# EAGLE design Frisbie_Board (EAGLE 9.0.1)
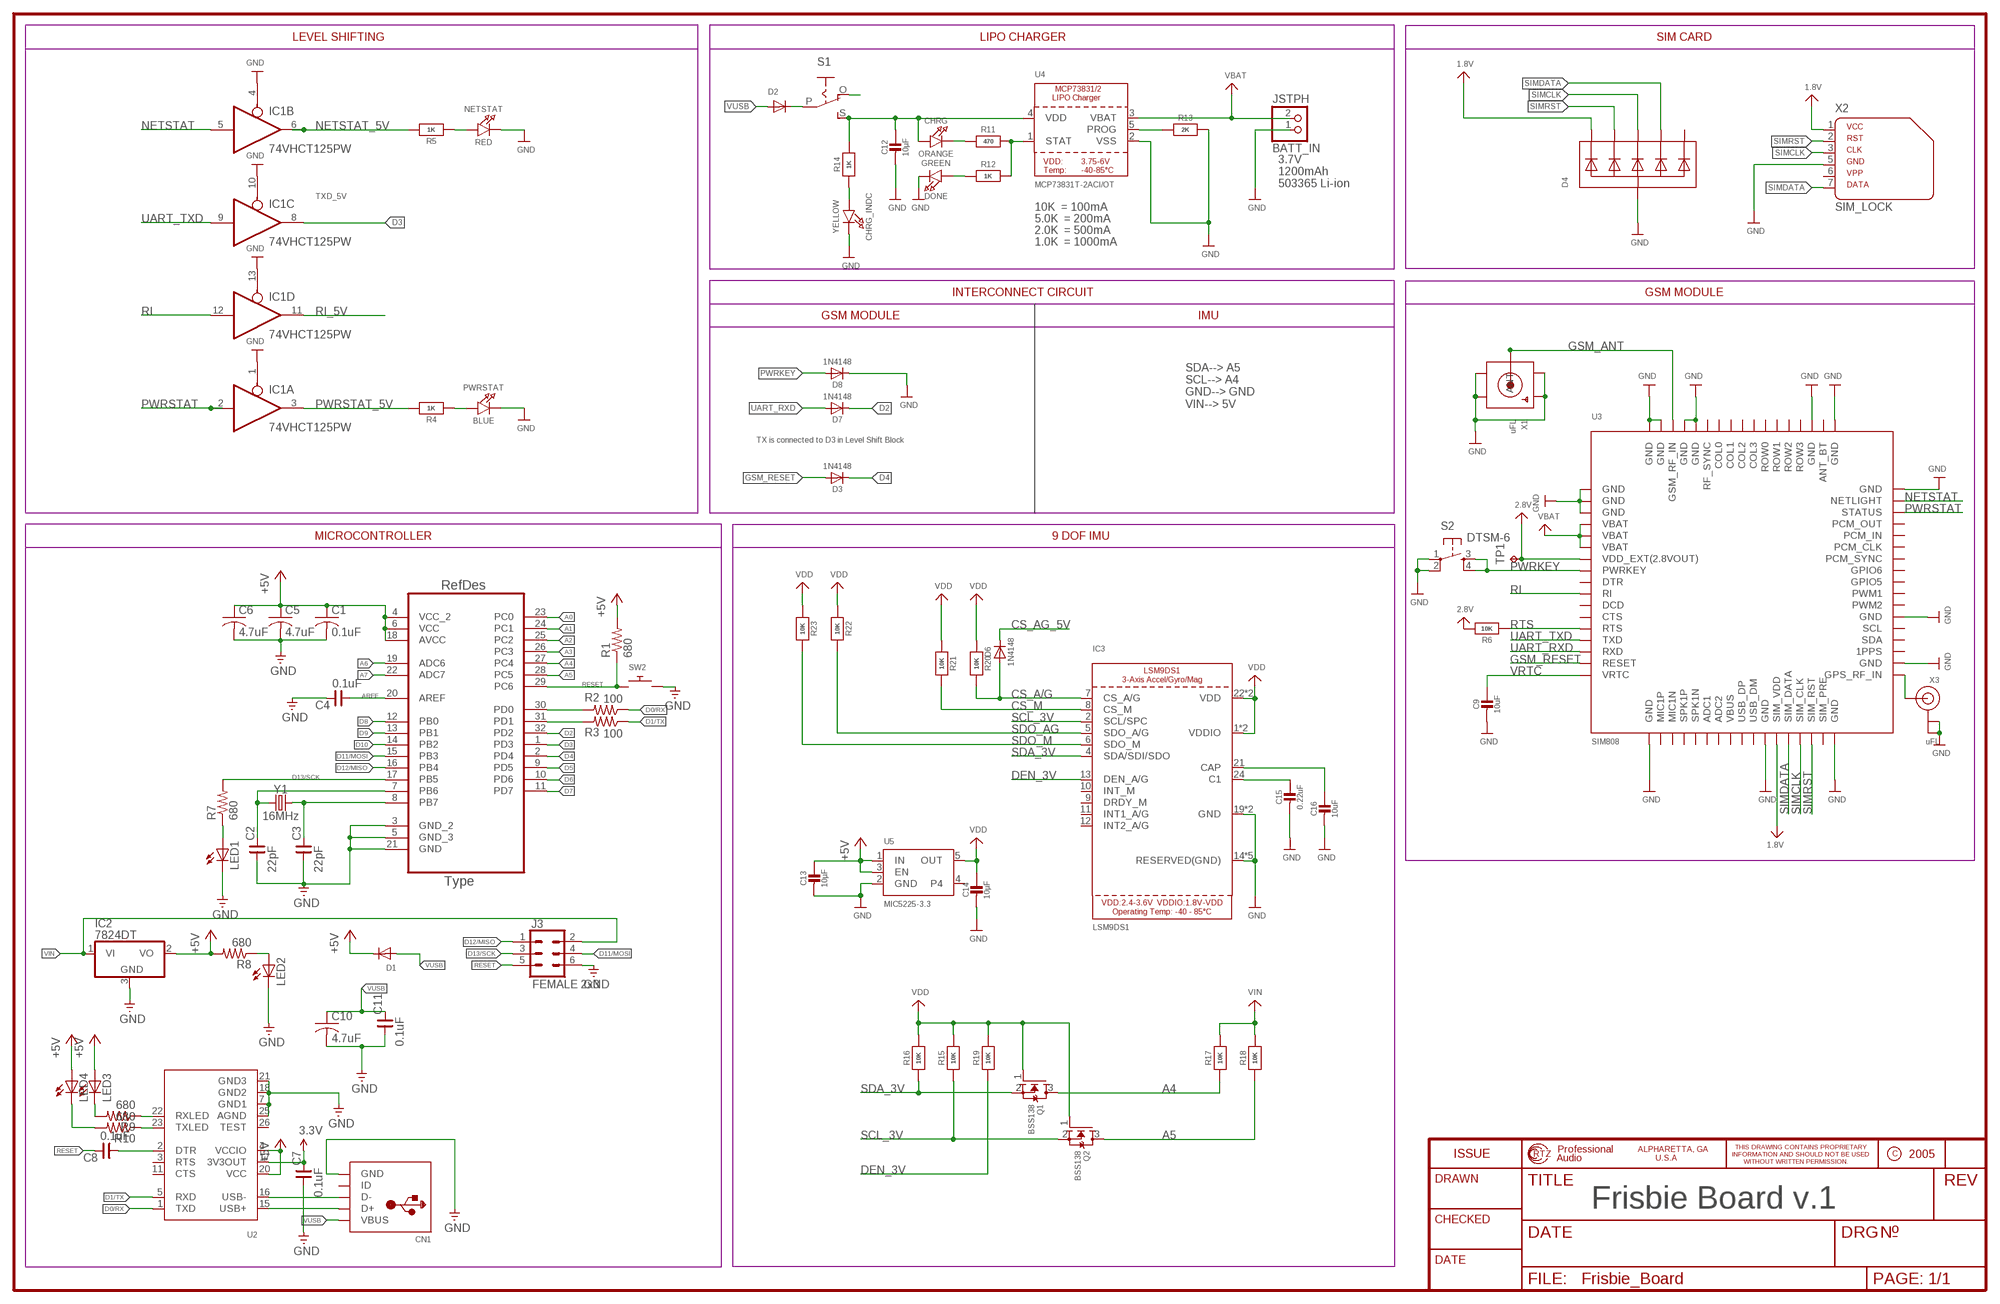
[diagram p0: schematic, sheet 1]

## Parts
BATT_IN  JSTPH  JST_2PIN  [JSTPH2]
C1  0.1uF  C-USC0805  [C0805]
C2  22pF  CNP-0805  [0805]
C3  22pF  CNP-0805  [0805]
C4  0.1uF  CNP-0805  [0805]
C5  4.7uF  C-USC0805  [C0805]
C6  4.7uF  C-USC0805  [C0805]
C7  0.1uF  CNP-0805  [0805]
C8  0.1uF  CNP-0805  [0805]
C9  10uF  CAP_CERAMIC0805-NOOUTLINE  [0805-NO]
C10  4.7uF  C-USC0805  [C0805]
C11  0.1uF  CNP-0805  [0805]
C12  10µF  CAP_CERAMIC0805-NOOUTLINE  [0805-NO]
C13  10µF  CAP_CERAMIC0805-NOOUTLINE  [0805-NO]
C14  10µF  CAP_CERAMIC0805-NOOUTLINE  [0805-NO]
C15  0.22uF  CAP_CERAMIC0805_10MGAP  [0805_10MGAP]
C16  10uF  CAP_CERAMIC0805-NOOUTLINE  [0805-NO]
CHRG  ORANGE  LED0805_NOOUTLINE  [CHIPLED_0805_NOOUTLINE]
CHRG_INDC  YELLOW  LED0805_NOOUTLINE  [CHIPLED_0805_NOOUTLINE]
CN1  USBMINIB  [USB-MINIB]
D1  DIODESOD-123  [SOD-123]
D2  DIODESOD-123  [SOD-123]
D3  1N4148  DIODESOD-323  [SOD-323]
D4  TVSARRAY_5LANE  [SOT363]
D6  1N4148  DIODESOD-323  [SOD-323]
D7  1N4148  DIODESOD-323  [SOD-323]
D8  1N4148  DIODESOD-323  [SOD-323]
DONE  GREEN  LED0805_NOOUTLINE  [CHIPLED_0805_NOOUTLINE]
IC1  74VHCT125PW  74ABT125PW  [TSSOP14]
IC2  7824DT  [TO252]
IC3  LSM9DS1  [LGA24_3.5X3.1MM]
J3  FEMALE 2x3  CONN_03X2FEMALE  [2X3]
LED1  LEDCHIPLED_0805  [CHIPLED_0805]
LED2  LEDCHIPLED_0805  [CHIPLED_0805]
LED3  LEDCHIPLED_0805  [CHIPLED_0805]
LED4  LEDCHIPLED_0805  [CHIPLED_0805]
NETSTAT  RED  LED0805_NOOUTLINE  [CHIPLED_0805_NOOUTLINE]
PWRSTAT  BLUE  LED0805_NOOUTLINE  [CHIPLED_0805_NOOUTLINE]
Q1  BSS138  MOSFET-NWIDE  [SOT23-WIDE]
Q2  BSS138  MOSFET-NWIDE  [SOT23-WIDE]
R1  680  R-US_R0805  [R0805]
R2  100  R-US_R0805  [R0805]
R3  100  R-US_R0805  [R0805]
R4  1K  RESISTOR0805_NOOUTLINE  [0805-NO]
R5  1K  RESISTOR0805_NOOUTLINE  [0805-NO]
R6  10K  RESISTOR0805_NOOUTLINE  [0805-NO]
R7  680  R-US_R0805  [R0805]
R8  680  R-US_R0805  [R0805]
R9  680  R-US_R0805  [R0805]
R10  680  R-US_R0805  [R0805]
R11  470  RESISTOR0805_NOOUTLINE  [0805-NO]
R12  1K  RESISTOR0805_NOOUTLINE  [0805-NO]
R13  2K  RESISTOR0805_NOOUTLINE  [0805-NO]
R14  1K  RESISTOR0805_NOOUTLINE  [0805-NO]
R15  10K  RESISTOR0805_NOOUTLINE  [0805-NO]
R16  10K  RESISTOR0805_10MGAP  [0805_10MGAP]
R17  10K  RESISTOR0805_NOOUTLINE  [0805-NO]
R18  10K  RESISTOR0805_NOOUTLINE  [0805-NO]
R19  10K  RESISTOR0805_NOOUTLINE  [0805-NO]
R20  10K  RESISTOR0805_NOOUTLINE  [0805-NO]
R21  10K  RESISTOR0805_NOOUTLINE  [0805-NO]
R22  10K  RESISTOR0805_10MGAP  [0805_10MGAP]
R23  10K  RESISTOR0805_NOOUTLINE  [0805-NO]
S1  EG1218S  [EG1218]
S2  DTSM-6  [DTSM-6]
SW2  SWITCH_PUSHBUTTONEVQ-PE  [TACT_PANA-EVQ]
TP1  TPTP11R  [TP11R]
U1  ATMEGA328P-AU  [QFP80P900X900X120-32N]
U2  FT232RLSSOP28  [SSOP28DB]
U3  SIM808  GSM_SIM808_LITERAL  [SIM900_SMT]
U4  MCP73831T-2ACI/OT  MCP73831/2  [SOT23-5]
U5  MIC5225-3.3  VREG_SOT23-5  [SOT23-5]
X1  uFL  SMACONNECTOR_EDGE_UFL  [SMA_EDGELAUNCH_UFL]
X2  SIM_LOCK  [SIM_5002]
X3  uFL  ANTENNA_U.FL  [U.FL]
Y1  16MHz  CRYSTAL-16MHZPTH-HC49US  [HC49US]

## Nets
1.8V: D4.1(C1) U3.P$29(SIM_VDD) X2.1
2.8V: R6.2 TP1.TP U3.P$7(VDD_EXT(2.8VOUT))
3.3V: C7.2 U2.17(3V3OUT)
+5V: C1.1 C5.1 C6.1 C13.1 D1.C IC2.2(VO) LED3.A LED4.A R1.2 R8.2 U1.4(VCC_2) U1.6(VCC) U1.18(AVCC) U2.4(VCCIO) U2.20(VCC) U5.1(IN) U5.3(EN)
A0: U1.23(PC0)
A1: U1.24(PC1)
A2: U1.25(PC2)
A3: U1.26(PC3)
A4: Q1.3(D) R17.1 U1.27(PC4)
A5: Q2.3(D) R18.1 U1.28(PC5)
A6: U1.19(ADC6)
A7: U1.22(ADC7)
AREF: C4.1 U1.20(AREF)
C1: C15.1 IC3.24(C1)
CAP: C16.1 IC3.21(CAP)
CS_A/G: D6.A IC3.7(CS_A/G) R20.2
CS_AG_5V: D6.C
CS_M: IC3.8(CS_M) R21.2
D0/RX: R2.1 U2.1(TXD)
D1/TX: R3.1 U2.5(RXD)
D2: D7.C U1.32(PD2)
D3: IC1.8(C:O) U1.1(PD3)
D4: D3.C U1.2(PD4)
D5: U1.9(PD5)
D6: U1.10(PD6)
D7: U1.11(PD7)
D8: U1.12(PB0)
D9: U1.13(PB1)
D10: U1.14(PB2)
D11/MOSI: J3.4 U1.15(PB3)
D12/MISO: J3.1 U1.16(PB4)
D13/SCK: J3.3 R7.2 U1.17(PB5)
DEN_3V: IC3.13(DEN_A/G) R19.1
GND: BATT_IN.1 C1.2 C2.1 C3.1 C4.2 C5.2 C6.2 C7.1 C9.2 C10.2 C11.1 C12.2 C13.2 C14.2 C15.2 C16.2 CHRG_INDC.C CN1.GND D4.2(A) D8.C DONE.C IC1.1(A:OE) IC1.4(B:OE) IC1.10(C:OE) IC1.13(D:OE) IC2.3(GND) IC3.14(RESERVED(GND)) IC3.15(RESERVED(GND)) IC3.16(RESERVED(GND)) IC3.17(RESERVED(GND)) IC3.18(RESERVED(GND)) IC3.19(GND) IC3.20(GND) J3.6 LED1.C LED2.C NETSTAT.C PWRSTAT.C R13.2 S2.1 S2.2 SW2.P$2 U1.3(GND_2) U1.5(GND_3) U1.21(GND) U2.7(GND1) U2.18(GND2) U2.21(GND3) U2.25(AGND) U3.P$1(GND) U3.P$2(GND) U3.P$3(GND) U3.P$18(GND) U3.P$28(GND) U3.P$34(GND) U3.P$36(GND) U3.P$40(GND) U3.P$51(GND) U3.P$52(GND) U3.P$54(GND) U3.P$64(GND) U3.P$65(GND) U3.P$67(GND) U3.P$68(GND) U4.2(VSS) U5.2(GND) X1.GND@1(GND1) X1.GND@2(GND2) X1.GND@3(GND3) X1.GND@4(GND4) X2.5 X3.1(GND) X3.2(GND)
GSM_ANT: U3.P$66(GSM_RF_IN) X1.P(ANT)
GSM_RESET: D3.A U3.P$16(RESET)
N$1: C3.2 U1.8(PB7) Y1.2
N$2: C2.2 U1.7(PB6) Y1.1
N$3: U3.P$35(GPS_RF_IN) X3.3(SIGNAL)
N$4: PWRSTAT.A R4.1
N$6: LED2.A R8.1
N$7: R2.2 U1.30(PD0)
N$8: R3.2 U1.31(PD1)
N$9: NETSTAT.A R5.1
N$10: CN1.D+ U2.15(USB+)
N$11: CN1.D- U2.16(USB-)
N$12: R9.1 U2.22(RXLED)
N$13: R10.1 U2.23(TXLED)
N$14: LED3.C R9.2
N$15: LED4.C R10.2
N$16: C8.1 U2.2(DTR)
N$17: CHRG.C R11.1
N$18: R11.2 R12.2 U4.1(STAT)
N$19: R13.1 U4.5(PROG)
N$20: DONE.A R12.1
N$21: C12.1 CHRG.A R14.2 S1.S U4.4(VDD)
N$22: D2.C S1.P
N$23: S1.O
N$24: CHRG_INDC.A R14.1
N$25: LED1.A R7.1
NETSTAT: IC1.5(B:I) U3.P$50(NETLIGHT)
NETSTAT_5V: IC1.6(B:O) R5.2
PWRKEY: D8.A S2.3 S2.4 U3.P$8(PWRKEY)
PWRSTAT: IC1.2(A:I) U3.P$49(STATUS)
PWRSTAT_5V: IC1.3(A:O) R4.2
RESET: C8.2 J3.5 R1.1 SW2.P$1 U1.29(PC6)
RI: IC1.12(D:I) U3.P$10(RI)
RI_5V: IC1.11(D:O)
RTS: R6.1 U3.P$13(RTS)
SCL_3V: IC3.2(SCL/SPC) Q2.2(S) R15.1
SDA_3V: IC3.4(SDA/SDI/SDO) Q1.2(S) R16.1
SDO_AG: IC3.5(SDO_A/G) R22.2
SDO_M: IC3.6(SDO_M) R23.2
SIMCLK: D4.4(C3) U3.P$31(SIM_CLK) X2.3
SIMDATA: D4.5(C4) U3.P$30(SIM_DATA) X2.7
SIMRST: D4.3(C2) U3.P$32(SIM_RST) X2.2
UART_RXD: D7.A U3.P$15(RXD)
UART_TXD: IC1.9(C:I) U3.P$14(TXD)
VBAT: BATT_IN.2 U3.P$4(VBAT) U3.P$5(VBAT) U3.P$6(VBAT) U4.3(VBAT)
VDD: C14.1 IC3.1(VDDIO) IC3.3(VDDIO) IC3.22(VDD) IC3.23(VDD) Q1.1(G) Q2.1(G) R15.2 R16.2 R19.2 R20.1 R21.1 R22.1 R23.1 U5.5(OUT)
VIN: IC2.1(VI) J3.2 R17.2 R18.2
VRTC: C9.1 U3.P$17(VRTC)
VUSB: C10.1 C11.2 CN1.VBUS D1.A D2.A
Unconnected: CN1.ID D4.6(C5) IC3.9(DRDY_M) IC3.10(INT_M) IC3.11(INT1_A/G) IC3.12(INT2_A/G) U2.3(RTS) U2.11(CTS) U2.26(TEST) U3.P$9(DTR) U3.P$11(DCD) U3.P$12(CTS) U3.P$19(MIC1P) U3.P$20(MIC1N) U3.P$21(SPK1P) U3.P$22(SPK1N) U3.P$23(ADC1) U3.P$24(ADC2) U3.P$26(USB_DP) U3.P$27(USB_DM) U3.P$33(SIM_PRE) U3.P$37(1PPS) U3.P$38(SDA) U3.P$39(SCL) U3.P$41(PWM2) U3.P$42(PWM1) U3.P$43(GPIO5) U3.P$44(GPIO6) U3.P$45(PCM_SYNC) U3.P$46(PCM_CLK) U3.P$47(PCM_IN) U3.P$48(PCM_OUT) U3.P$53(ANT_BT) U3.P$55(ROW3) U3.P$56(ROW2) U3.P$57(ROW1) U3.P$58(ROW0) U3.P$59(COL3) U3.P$60(COL2) U3.P$61(COL1) U3.P$62(COL0) U3.P$63(RF_SYNC) U5.4 X2.6

## Notes on the sheet
- LEVEL SHIFTING | LIPO CHARGER | SIM CARD
- 3.7V
  1200mAh
  503365 Li-ion
- TXD_5V
- 10K  = 100mA
- 5.0K  = 200mA
- 2.0K  = 500mA
- 1.0K  = 1000mA
- INTERCONNECT CIRCUIT | GSM MODULE
- GSM MODULE | IMU
- SDA--> A5
  SCL--> A4
  GND--> GND
  VIN--> 5V
- TX is connected to D3 in Level Shift Block
- MICROCONTROLLER | 9 DOF IMU
- Frisbie Board v.1

## Power pins joined to a net without a drawn wire
GND: IC1.7(P:GND)
VCC: IC1.14(P:VCC)
VUSB: U3.P$25(VBUS)

## Library data of the parts
BATT_IN = microbuilder:JST_2PIN: JST 2-Pin Right-Angle Connector PH-Series - 4UConnector: 17311 SH-Series - 4UConnector: 07278
C1 C5 C6 C10 = adafruit:C-US: CAPACITOR, American symbol
C2-C4 C7 C8 C11 = cap-master:CNP-: NON-POLARIZED CAP
C9 C12-C16 = microbuilder:CAP_CERAMIC: Ceramic Capacitors For new designs, use the packages preceded by an '_' character since they are more reliable: The following footprints should be used on most boards: _0402 - Standard footprint for regular board layouts _0603 - Standard footprint for regular board layouts _0805 - Standard footprint for regular board layouts _1206 - Standard footprint for regular board layouts For extremely tight-pitch boards where space is at a premium, the following 'micro-pitch' footprints can be used (smaller pads, no silkscreen outline, etc.): _0402MP - Micro-pitch footprint for very dense/compact boards _0603MP - Micro-pitch footprint for very dense/compact boards _0805MP - Micro-pitch footprint for very dense/compact boards _1206MP - Micro-pitch footprint for very dense/compact boards
CHRG CHRG_INDC DONE NETSTAT PWRSTAT = microbuilder:LED: LED
CN1 = adafruit:USB: USB Connectors USBMINIB - Surface Mount Female Mini-B USB Connector 4UConnector: 06564 By microbuilder.eu Thru-hole RA Female Mini-B USB Connector 4UConnector: 18732 By ladyada.net
D1 D2 = adafruit:DIODE: Diode
D3 D6-D8 = microbuilder:DIODE: Diode
D4 = microbuilder:TVSARRAY_5LANE: Voltage Transient Suppressor Array SOT363 SMF05C - 100W 5V: Digikey - SMF05CT1GOSCT-ND
IC1 = 74xx-us:74*125: Quad bus BUFFER, 3-state
IC2 = adafruit:78*: Positive VOLTAGE REGULATOR Added bigger pads to the TO-92 package
IC3 = microbuilder:LSM9DS1
J3 = SparkFun-Connectors:CONN_03X2: Multi connection point. Often used as Generic Header-pin footprint for 0.1 inch spaced/style header connections You can populate with any combo of single row headers, but if you'd like an exact match, check these: Header - 2x3 (Male, 0.1") <https://www.sparkfun.com/products/12807> (PRT-12807) Header - 2x3 (Female, 0.1") <https://www.sparkfun.com/products/13010> (PRT-13010) 2x3 Pin Shrouded Header <https://www.sparkfun.com/products/10877> (PRT-10877) On any of the 0.1 inch spaced packages, you can populate with these: Break Away Headers - Straight <https://www.sparkfun.com/products/116> (PRT-00116) Break Away Male Headers - Right Angle <https://www.sparkfun.com/products/553> (PRT-00553) Female Headers <https://www.sparkfun.com/products/115> (PRT-00115) Break Away Headers - Machine Pin <https://www.sparkfun.com/products/117> (PRT-00117) Break Away Female Headers - Swiss Machine Pin <https://www.sparkfun.com/products/743> (PRT-00743) Special note: the shrouded connector mates well with our 3x2 ribbon cables: Ribbon Crimp Connector - 6-pin (2x3, Female) <https://www.sparkfun.com/products/10651> (PRT-10651) Ribbon Cable - 6 wire (15ft) <https://www.sparkfun.com/products/10646> (PRT-10646); PROD_ID: CONN-11566
LED1-LED4 = adafruit:LED: LED
Q1 Q2 = microbuilder:MOSFET-N: N-Channel Mosfet LEGEND VDS: Voltage Drain-Source ID: Drain Current RDS(ON): Drain-Source On-State Resistance VGS(TH): Gate-Source Threshold Voltage CISS: Drain-Source Input Capacitance SOT-23 Name VDS ID RDS(ON) VGS(TH) CISS Order Number 2N7002E 60V 260mA 2.5 Ohm 2.5V @ 250uA 26.7pF @ 25V 2N7002ET1GOSTR-ND BSH103 30V 850mA 400 mOhm 400mV @ 1mA 83pF @ 24V BSH103,235-ND BSS138 60V 320mA 1.6 Ohm 1.5V @ 250uA 50pF @ 10V Mouser: 771-BSS138PW115 DMN2075U-7 20V 4.2A 38 mOhm 1V @ 250 uA 594.3pF @ 10V DMN2075U-7DICT-ND * BSS138 good choice for I2C level-shifting POWERPAK 1212-8 Name VDS ID RDS(ON) VGS(TH) CISS Order Number Si7308DN 60V 6A 58 mOhm 3V @ 250uA 665pF @ 15V SI7308DN-T1-E3CT-ND
R1-R3 R7-R10 = adafruit:R-US_: RESISTOR, American symbol
R4-R6 R11-R23 = microbuilder:RESISTOR: Resistors For new designs, use the packages preceded by an '_' character since they are more reliable: The following footprints should be used on most boards: _0402 - Standard footprint for regular board layouts _0603 - Standard footprint for regular board layouts _0805 - Standard footprint for regular board layouts _1206 - Standard footprint for regular board layouts For extremely tight-pitch boards where space is at a premium, the following 'micro-pitch' footprints can be used (smaller pads, no silkscreen outline, etc.): _0402MP - Micro-pitch footprint for very dense/compact boards _0603MP - Micro-pitch footprint for very dense/compact boards _0805MP - Micro-pitch footprint for very dense/compact boards _1206MP - Micro-pitch footprint for very dense/compact boards
S1 = adafruit:EG1218: SLIDING SWITCH 0.1" spacing through hole, vertical SPDT slide switch http://www.ladyada.net/library/pcb/eaglelibrary.html
S2 = switch-tact:DTSM-6
SW2 = adafruit:SWITCH_PUSHBUTTON: Buttons SOFTTOUCHSMD_SJ - Soft touch temporary push button (Super Junk Akihabara) Compatible with SKPMANE010 [Mouser: 688-SKPMAN] C&K_KSS = Digikey: KSS221GLFS
TP1 = testpad:TP: Test pad
U1 = Atmel-ATMEGA328P-AU:ATMEGA328P-AU; DESCRIPTION: 8-bit Microcontroller with In-System Programmable Flash; MPN: ATMEGA328P-AU; OC_FARNELL: 1715486; OC_NEWARK: 14R4631; PACKAGE: TQFP-32; SUPPLIER: Atmel
U2 = microbuilder:FT232RL: FTDI FT232RL USB TO RS232 Converter Digikey: 768-1007-1-ND
U3 = microbuilder:GSM_SIM808_LITERAL: SIM808 GSM Module
U4 = microbuilder:MCP73831/2: MCP73831/2 LIPO Charger VDD: 3.75 - 6V Temp -40 - 85°C Programmable Charge Rate: 15-500mA NOTE: STAT is a tri-state logic output on the MCP73831 and an open-drain output on the MCP73832. SOT23-5 with 4.2V output and tri-state logic on STAT = MCP73831T-2ACI/OT
U5 = microbuilder:VREG_SOT23-5: SOT23-5 Fixed Voltage Regulators Part Current Out V Out V In V Dropout θJA (°C/W) TJ (°C) Digikey Part No. ADP121 150mA 3.3V 3.4-5.5V 0.09V @ 150mA -- -- ADP121-AUJZ33R7CT-ND ADP121 150mA 3.0V 3.1-5.5V 0.09V @ 150mA -- -- ADP121-AUJZ30R7CT-ND ADP122 300mA 3.3V 3.4-5.5V 0.085V @ 300mA -- -- ADP122AUJZ-3.3-R7CT-ND ADP1712 300mA 3.3V 3.5-5.5V 0.17V @ 300mA -- -- ADP1712AUJZ-3.3-R7TR-ND AP7311 (Low Cost) 150mA 3.3V 3.5-6V 0.15V @ 150mA -- -- AP7311-33WG-7DICT-ND LD39015M18R 150mA 1.8V 1.9V-5.5V 0.08V @ 100mA -- -- 497-6977-1-ND LP2985A-33DBVR 150mA 3.3V 3.3-16V 0.28V @ 150mA 206 150 296-18479-1-ND MCP1824T-3302E/OT 300mA 3.3V 3.5V-6V 0.2V @ 300mA -- -- MCP1824T-3302E/OTCT-ND MIC5205-2.5YM5 TR 150mA 2.5V 2.7-16V 0.165V @ 150mA -- -- 576-1257-2-ND MIC5205-3.0YM5 TR 150mA 3.0V 3.2V-16V 0.165V @ 150mA -- -- 576-1258-2-ND MIC5205-3.3YM5 TR 150mA 3.3V 3.5V-16V 0.165V @ 150mA -- -- 576-1259-2-ND TPS780330220 150mA 3.3V+2.2V 3.6-5.5V 250mV Max -- -- 296-23332-1-ND TDA3663/N1,135 100mA 3.3V 3.5-45V 0.18V @ 50mA -- -- 568-5343-1-ND Max operating temp can be calculated using θJA, TJ (max junction temperature), and power in watts. Set the "Maximum Ambient Temperature" until it reaches TJ ("Max Junction Temperature"), which is the absolute limit for safe use of the regulator: Heat Sink Temperature Calculator <http://www.daycounter.com/Calculators/Heat-Sink-Temperature-Calculator.phtml> For example, With 12V source into a 3.3V LP2985 and a 30mA load, we are dissipating (12V-3.3V) * 0.03A = 0.261W. With a θJA of 206 °C/W, a TJ of 150°C, and 261mW we can safely use the chip without a heat sink up to 75°C (=147.1°C Junction Temperature).
X1 = microbuilder:SMACONNECTOR: SMA Connector 90° DIP SMA Connector, 50 Ohm (4UConnector: 07259)
X2 = microbuilder:SIM_LOCK: C707A SIMLOCK® 2.5 mm with wide solder tails Source: Data sheet <http://www.amphenol.info/downloads/C707_10M006_512_2.pdf>
X3 = microbuilder:ANTENNA_U.FL: U.FL Antenna Connector
Y1 = SparkFun-Clocks:CRYSTAL-16MHZ: 16MHz Crystal Digikey Example <http://www.digikey.com/product-search/en?keywords=535-9122-1-ND> Frequency: 16MHz Frequency Stability: ±50ppm Frequency Tolerance: ±20ppm Load Capacitance: 18pF SparkFun Products: Pro Micro -5V/16MHz <https://www.sparkfun.com/products/12640> SparkFun Serial Enabled LCD Kit <https://www.sparkfun.com/products/10097>; PROD_ID: XTAL-08181; SF_ID: COM-00536

## Board
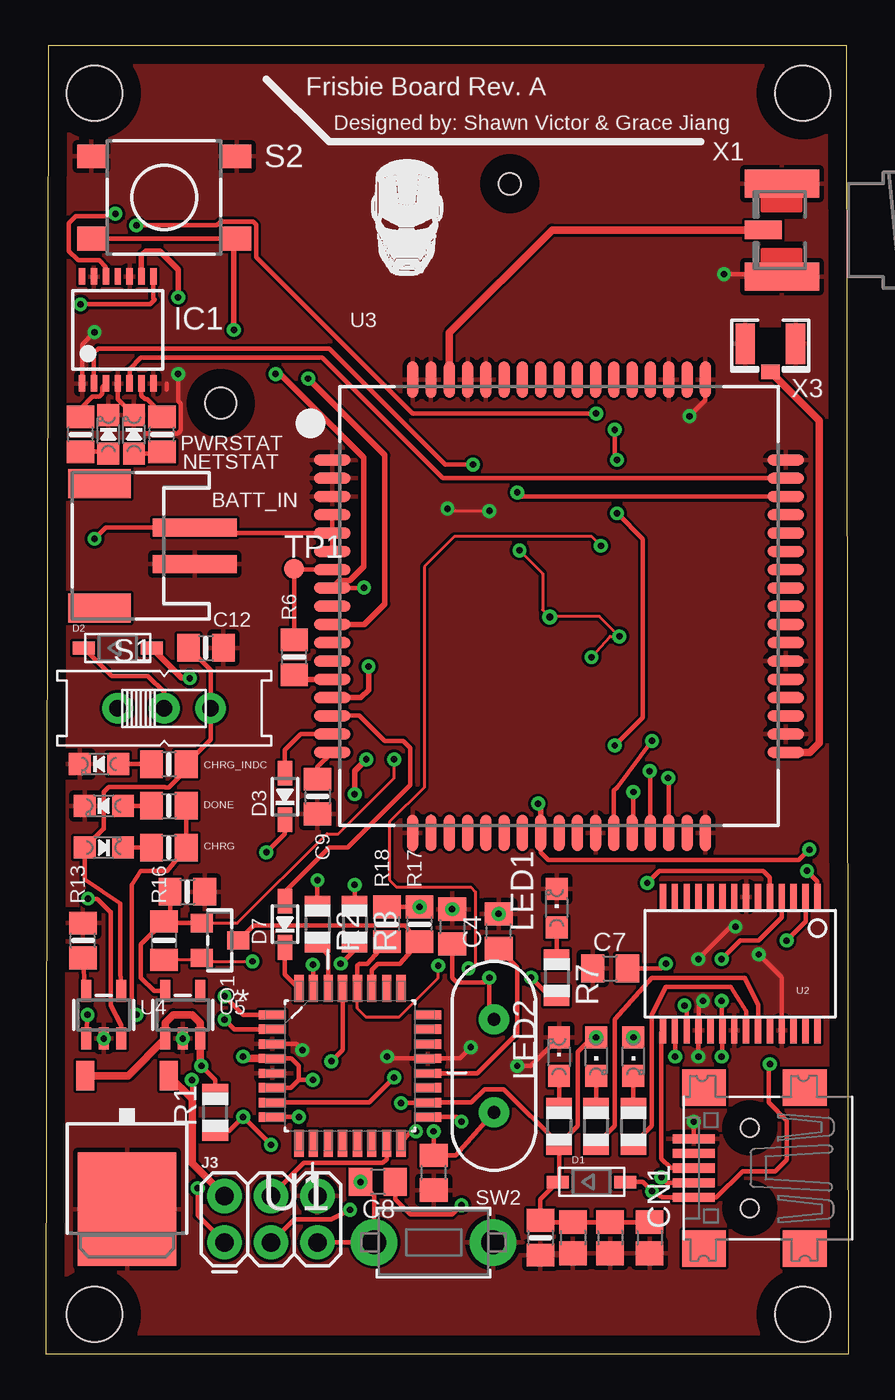
[diagram p1: board, top side]
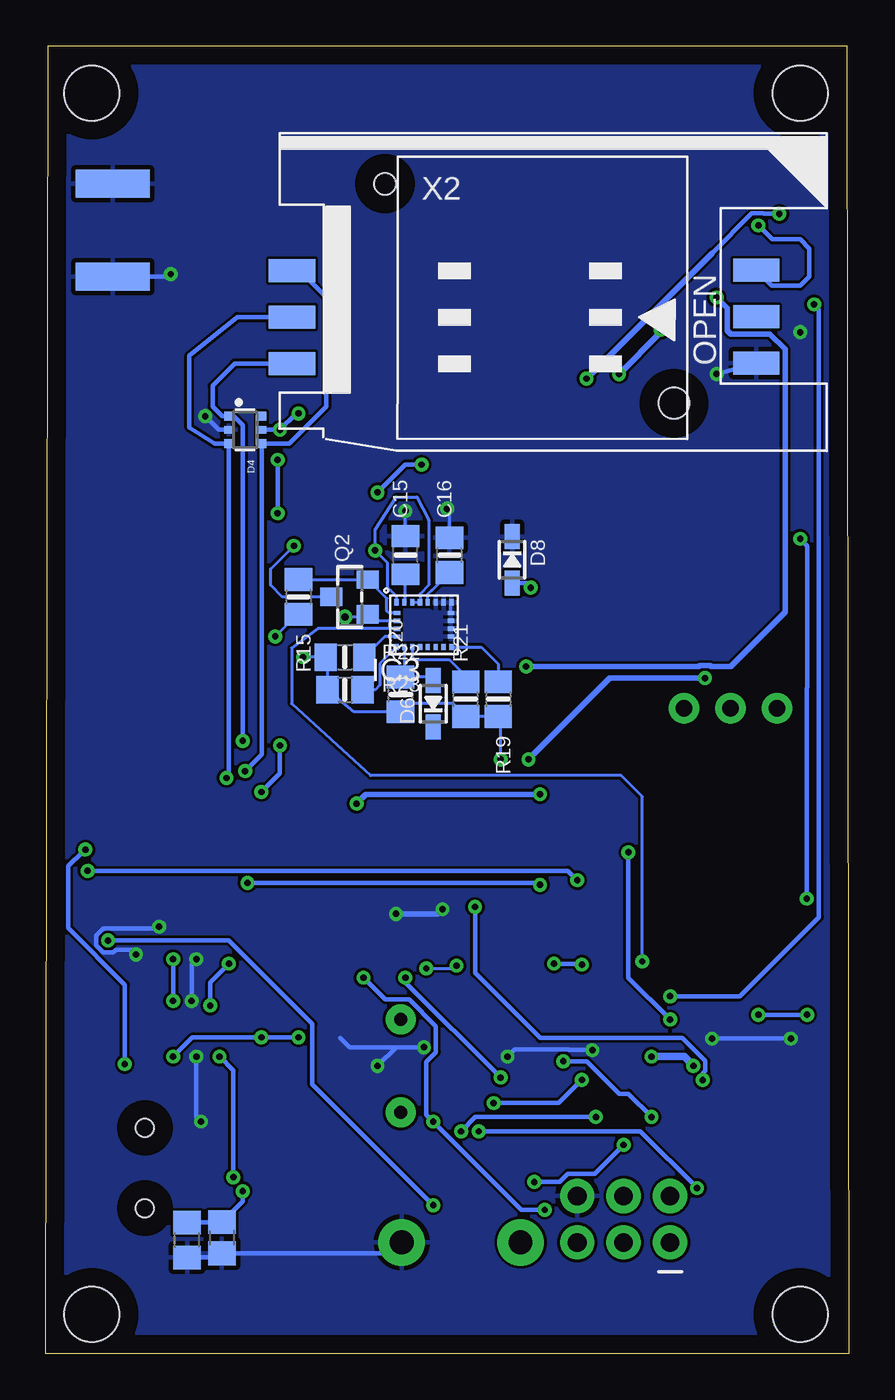
[diagram p2: board, bottom side, seen from below]

Size 43.92 x 71.55 mm. Coordinates in mm from the lower left corner, seen from the top.
Outline: 0,0 43.92,0 43.8,71.55 0.13,71.55 0,0
Copper layers (1*16): Top 0.035mm / dielectric 1.5mm / Bottom 0.035mm
Design rules "default": minimum track width 6mil, minimum drill 0.35mm, track to track 6mil, track to pad 6mil, pad to pad 6mil, via to via 6mil, smd to smd 6mil, copper to edge 40mil, drill to drill 6mil, minimum pad ring 10mil, minimum via ring 8mil, stop-mask expansion 4mil, vias tented up to drill 0mil, thermal gap 10mil
Holes 3.02 mm at 2.67,2.16 41.4,2.16 2.67,68.96 41.4,68.96

### Footprints (pad centres in the part's own frame; a part is rotated, then mirrored left to right if it is on the bottom)
JSTPH2 = smd 1 x 4.6: 1 -1,-3.7; 2 1,-3.7 | smd 1.6 x 3.4: NC1 -3.4,1.5; NC2 3.4,1.5
C0805 = smd 1.3 x 1.5: 1 -0.85,0; 2 0.85,0
0805 = smd 1.27 x 1.524: 1 -0.953,0; 2 0.953,0
0805-NO = smd 1.24 x 1.5: 1 -0.95,0; 2 0.95,0
0805_10MGAP = smd 1.2 x 1.5: 1 -1.05,0; 2 1.05,0
CHIPLED_0805_NOOUTLINE = smd 1.2 x 1.2: A 0,-1.05; C 0,1.05
USB-MINIB = smd 0.5 x 2.308: D+ 0,4.064; D- -0.8,4.064; GND 1.6,4.064; ID 0.8,4.064; VBUS -1.6,4.064 | smd 2 x 2.4: GND1 -4.4,-2; GND2 -4.4,3.5; GND3 4.4,3.5; GND4 4.4,-2 | hole 1: -2.2,1; 2.2,1
SOD-123 = smd 1.2 x 0.7: A 1.85,0; C -1.85,0
SOD-323 = smd 1.35 x 0.8: A 1.27,0; C -1.27,0
SOT363 = smd 0.5 x 0.5: 1 -0.75,-0.9; 3 0.75,-0.9; 4 0.75,0.9; 6 -0.75,0.9 | smd 0.4 x 0.5: 2 0,-0.9; 5 0,0.9
TSSOP14 = smd 0.35 x 0.9: 1 -1.95,-2.925; 2 -1.3,-2.925; 3 -0.65,-2.925; 4 0,-2.925; 5 0.65,-2.925; 6 1.3,-2.925; 7 1.95,-2.925; 8 1.95,2.925; 9 1.3,2.925; 10 0.65,2.925; 11 0,2.925; 12 -0.65,2.925; 13 -1.3,2.925; 14 -1.95,2.925
TO252 = smd 1 x 1.6: 1 -2.28,-4.8; 2 2.28,-4.8 | smd 5.4 x 6.2: 3 0,2.5
LGA24_3.5X3.1MM = smd 0.23 x 0.35: 1 -1.505,1.22; 6 -1.505,-1.22; 7 -1.075,-1.22; 8 -0.645,-1.22; 9 -0.215,-1.22; 10 0.215,-1.22; 11 0.645,-1.22; 12 1.075,-1.22; 13 1.505,-1.22; 18 1.505,1.22; 19 1.075,1.22; 20 0.645,1.22; 21 0.215,1.22; 22 -0.215,1.22; 23 -0.645,1.22; 24 -1.075,1.22 | smd 0.35 x 0.23: 2 -1.475,0.645; 3 -1.475,0.215; 4 -1.475,-0.215; 5 -1.475,-0.645; 14 1.475,-0.645; 15 1.475,-0.215; 16 1.475,0.215; 17 1.475,0.645
2X3 = drill 1.016 pad 1.88: 1 0,0; 2 0,2.54; 3 2.54,0; 4 2.54,2.54; 5 5.08,0; 6 5.08,2.54
CHIPLED_0805 = smd 1.2 x 1.2: A 0,-1.05; C 0,1.05
SOT23-WIDE = smd 1 x 1.2: 1 -0.95,-1; 2 0.95,-1; 3 0,1
R0805 = smd 1.1 x 1.4: 1 -1,0; 2 1,0
EG1218 = drill 0.9 pad 1.676: O -2.54,0; P 0,0; S 2.54,0
DTSM-6 = smd 1.55 x 1.3: 1 -3.975,2.25; 2 3.975,2.25; 3 -3.975,-2.25; 4 3.975,-2.25
TACT_PANA-EVQ = drill 1.3 pad 2.54: P$1 -3.25,0; P$2 3.25,0
TP11R = smd 1.1 x 1.1: TP 0,0
QFP80P900X900X120-32N = smd 1.473 x 0.508: 1 -4.242,2.794; 2 -4.242,2.007; 3 -4.242,1.194; 4 -4.242,0.406; 5 -4.242,-0.406; 6 -4.242,-1.194; 7 -4.242,-2.007; 8 -4.242,-2.794; 17 4.242,-2.794; 18 4.242,-2.007; 19 4.242,-1.194; 20 4.242,-0.406; 21 4.242,0.406; 22 4.242,1.194; 23 4.242,2.007; 24 4.242,2.794 | smd 0.508 x 1.473: 9 -2.794,-4.242; 10 -2.007,-4.242; 11 -1.194,-4.242; 12 -0.406,-4.242; 13 0.406,-4.242; 14 1.194,-4.242; 15 2.007,-4.242; 16 2.794,-4.242; 25 2.794,4.242; 26 2.007,4.242; 27 1.194,4.242; 28 0.406,4.242; 29 -0.406,4.242; 30 -1.194,4.242; 31 -2.007,4.242; 32 -2.794,4.242
SSOP28DB = smd 0.348 x 1.397: 1 -4.225,-3.656; 2 -3.575,-3.656; 3 -2.925,-3.656; 4 -2.275,-3.656; 5 -1.625,-3.656; 6 -0.975,-3.656; 7 -0.325,-3.656; 8 0.325,-3.656; 9 0.975,-3.656; 10 1.625,-3.656; 11 2.275,-3.656; 12 2.925,-3.656; 13 3.575,-3.656; 14 4.225,-3.656; 15 4.225,3.656; 16 3.575,3.656; 17 2.925,3.656; 18 2.275,3.656; 19 1.625,3.656; 20 0.975,3.656; 21 0.325,3.656; 22 -0.325,3.656; 23 -0.975,3.656; 24 -1.625,3.656; 25 -2.275,3.656; 26 -2.925,3.656; 27 -3.575,3.656; 28 -4.225,3.656
SIM900_SMT = smd 2 x 0.6: P$1 -12.4,8; P$2 -12.4,7; P$3 -12.4,6; P$4 -12.4,5; P$5 -12.4,4; P$6 -12.4,3; P$7 -12.4,2; P$8 -12.4,1; P$9 -12.4,0; P$10 -12.4,-1; P$11 -12.4,-2; P$12 -12.4,-3; P$13 -12.4,-4; P$14 -12.4,-5; P$15 -12.4,-6; P$16 -12.4,-7; P$17 -12.4,-8; P$35 12.4,-8; P$36 12.4,-7; P$37 12.4,-6; P$38 12.4,-5; P$39 12.4,-4; P$40 12.4,-3; P$41 12.4,-2; P$42 12.4,-1; P$43 12.4,0; P$44 12.4,1; P$45 12.4,2; P$46 12.4,3; P$47 12.4,4; P$48 12.4,5; P$49 12.4,6; P$50 12.4,7; P$51 12.4,8 | smd 0.6 x 2: P$18 -8,-12.4; P$19 -7,-12.4; P$20 -6,-12.4; P$21 -5,-12.4; P$22 -4,-12.4; P$23 -3,-12.4; P$24 -2,-12.4; P$25 -1,-12.4; P$26 0,-12.4; P$27 1,-12.4; P$28 2,-12.4; P$29 3,-12.4; P$30 4,-12.4; P$31 5,-12.4; P$32 6,-12.4; P$33 7,-12.4; P$34 8,-12.4; P$52 8,12.4; P$53 7,12.4; P$54 6,12.4; P$55 5,12.4; P$56 4,12.4; P$57 3,12.4; P$58 2,12.4; P$59 1,12.4; P$60 0,12.4; P$61 -1,12.4; P$62 -2,12.4; P$63 -3,12.4; P$64 -4,12.4; P$65 -5,12.4; P$66 -6,12.4; P$67 -7,12.4; P$68 -8,12.4
SOT23-5 = smd 0.55 x 1.2: 1 -0.95,-1.3; 2 0,-1.3; 3 0.95,-1.3; 4 0.95,1.3; 5 -0.95,1.3
SMA_EDGELAUNCH_UFL = smd 4.064 x 1.524: GND@1 2.032,-2.54; GND@2 2.032,2.54 | smd 4.064 x 1.524 bottom: GND@3 2.032,2.54; GND@4 2.032,-2.54 | smd 2.032 x 1.016: P 3.048,0
SIM_5002 = smd 2.54 x 1.27: 1 0.904,0.574; 2 0.904,3.114; 3 0.904,5.654; 5 26.299,0.594; 6 26.299,3.134; 7 26.299,5.674 | hole 1.7: 21.8,-1.6 | hole 1.2: 6,10.4
U.FL = smd 2.2 x 1.05: 1 0,1.375; 2 0,-1.375 | smd 0.8 x 1: 3 1.525,0
HC49US = drill 0.7 pad 1.651: 1 -2.54,0; 2 2.54,0

### Placement (x,y rotation side)
BATT_IN  4.45,44.2 90 top
C1  33.02,6.35 270 top
C2  22.23,23.37 270 top
C3  21.21,9.91 90 top
C4  24.77,23.11 90 top
C5  28.83,6.35 270 top
C6  30.86,6.35 270 top
C7  30.86,21.08 0 top
C8  18.16,9.4 180 top
C9  14.86,30.48 270 top
C10  34.29,6.35 270 bottom
C11  36.2,6.22 90 bottom
C12  8.76,38.61 0 top
C13  27.05,6.35 270 top
C14  7.75,25.27 0 top
C15  24.26,43.69 90 bottom
C16  21.84,43.69 90 bottom
CHRG  3.17,27.69 270 top
CHRG_INDC  2.92,32.26 90 top
CN1  39.5,10.16 90 top
D1  29.84,9.4 0 top
D2  3.94,38.61 0 top
D3  13.08,30.48 90 top
D4  33.02,50.55 270 bottom
D6  22.73,35.56 90 bottom
D7  13.08,23.5 90 top
D8  18.41,43.43 270 bottom
DONE  3.17,29.97 90 top
IC1  3.94,56.01 0 top
IC2  4.45,10.41 180 top
IC3  23.24,39.88 0 bottom
J3  9.78,6.1 0 top
LED1  27.94,24.38 0 top
LED2  28.07,16.26 0 top
LED3  32.13,16.26 180 top
LED4  30.1,16.26 180 top
NETSTAT  4.83,50.29 0 top
PWRSTAT  3.43,50.29 0 top
Q1  9.53,22.61 270 top
Q2  27.3,41.4 90 bottom
R1  9.27,13.21 90 top
R2  14.86,23.5 270 top
R3  16.89,23.5 270 top
R4  1.91,50.29 90 top
R5  6.35,50.29 90 top
R6  13.59,38.1 90 top
R7  27.94,20.57 270 top
R8  28.07,12.45 270 top
R9  32.13,12.45 90 top
R10  30.1,12.45 90 top
R11  6.73,27.69 0 top
R12  6.73,29.97 0 top
R13  2.03,22.61 90 top
R14  6.73,32.26 0 top
R15  30.1,41.4 270 bottom
R16  6.48,22.61 90 top
R17  20.45,23.5 90 top
R18  18.67,23.5 90 top
R19  19.18,35.81 270 bottom
R20  24.51,36.07 90 bottom
R21  20.95,35.81 90 bottom
R22  27.56,38.1 0 bottom
R23  27.56,36.32 0 bottom
S1  6.48,35.31 0 top
S2  6.48,63.25 0 top
SW2  21.21,6.1 0 top
TP1  13.59,42.93 0 top
U1  16.64,15.75 0 top
U2  37.97,21.34 180 top
U3  28.07,40.89 0 top
U4  3.17,18.54 0 top
U5  7.49,18.54 0 top
X1  42.29,61.47 180 top
X2  31.37,53.59 0 bottom
X3  39.62,55.24 270 top
Y1  24.51,15.75 270 top

### Tracks (layer width: path | path; a pad name or v marks a point on that pad's centre or on a via)
1.8V  (via drill 0.35)
  Top 0.254: v33.15,33.53 31.24,30.99 31.07,30.81 U3.P$29
  Bottom 0.254: X2.1 33.59,54.17 34.8,52.96 34.8,51.82 34.28,51.3 D4.1 33.64,51.3 33.15,50.8 v33.15,33.53
2.8V
  Top 0.254: U3.P$7 13.62,42.89 | 13.62,42.89 TP1.TP | R6.2 13.59,42.86 13.62,42.89
3.3V  (via drill 0.35)
  Top 0.254: U2.17 35.05,18.93 v34.92,19.05 | v33.91,21.34 33.66,21.08 C7.2
  Bottom 0.254: v34.92,19.05 34.92,20.32 v33.91,21.34
+5V  (via drill 0.35)
  Top 0.254: C1.1 C6.1 C5.1 27.15,7.2 C13.1 27.05,8.45 D1.C 28.07,9.47 R8.2 | R8.2 29.08,12.46 29.08,16.51 29.88,17.31 LED4.A | v36.96,16.26 37,16.3 U2.20 36.96,17.72 v36.96,19.3 | R8.2 25.04,14.48 24,14.48 23.27,13.74 U1.18 20.85,13.72 v19.43,13.72 | U1.6 13.41,14.55 13.84,14.99 | 13.84,14.99 13.84,15.75 13.44,16.15 U1.4 | 13.84,14.99 v14.61,14.99 | 8.44,15.81 v8.51,15.75 9.27,14.99 R1.2 | U2.4 40.25,23.87 38.99,22.61 37.97,22.61 v36.96,21.59
  Top 0.406: IC2.2 4.51,15.21 U5.1 6.54,18.1 6.99,18.54 8,18.54 8.44,18.1 U5.3 8.44,15.81 | U1.4 10.9,16.15 v10.79,16.26
  Bottom 0.254: LED4.A LED3.A 35.91,17.31 v36.96,16.26 | v14.61,14.99 15.88,13.72 v19.43,13.72 | v36.96,21.59 v36.96,19.3
  Bottom 0.406: v10.79,16.26 9.02,16.26 v8.51,15.75
  other vias: 30.1,17.31 32.13,17.31
A4
  Top 0.254: U1.27 17.83,21.01 18.16,21.34 19.36,21.34 R17.1 20.43,22.42 19.66,23.44 11.36,23.44 Q1.3
A5  (via drill 0.35)
  Top 0.152: v30.35,44.2 29.84,44.7 22.35,44.7 20.7,43.05 20.7,30.99 18.8,29.08 18.8,25.91 19.18,25.53 23.24,25.53 23.5,25.27 23.5,21.34 23.24,21.08 v23.11,21.08 | v21.46,21.23 21.46,20.57 19.3,18.42 17.53,18.42 17.02,18.92 17.04,18.95 U1.28
  Top 0.254: U1.28 17.04,21.23 17.14,21.34 17.59,21.34 R18.1
  Bottom 0.152: Q2.3 30.99,41.4 31.62,42.04 31.62,42.93 v30.35,44.2 | v23.11,21.08 21.61,21.08 v21.46,21.23
AREF
  Top 0.254: U1.20 23.6,15.34 25.78,17.53 25.78,21.15 C4.1
C1
  Bottom 0.152: IC3.24 24.26,41.16 C15.1
CAP
  Bottom 0.152: IC3.21 23.03,41.57 22.84,41.76 22.82,41.76 C16.1
CS_A/G
  Bottom 0.152: D6.A 22.92,37.02 24.38,37.02 | 24.38,37.02 R20.2 | IC3.7 24.32,37.09 24.38,37.02
CS_M
  Bottom 0.152: IC3.8 23.89,38.11 23.75,37.97 21.84,37.97 20.95,37.08 R21.2
D0/RX  (via drill 0.35)
  Top 0.254: 41.79,26.26 v41.63,26.42 42.2,25.85 U2.1 | v14.86,25.91 R2.1
  Bottom 0.254: v41.63,26.42 15.37,26.42 v14.86,25.91
D1/TX  (via drill 0.35)
  Top 0.254: U2.5 39.6,26.06 39.24,26.42 33.55,26.42 v32.89,25.76 | v16.89,25.65 R3.1
  Bottom 0.254: v32.89,25.76 17,25.76 v16.89,25.65
D2
  Top 0.254: U1.32 13.08,20.75 D7.C
D3  (via drill 0.35)
  Top 0.254: U1.1 10.79,18.54 v9.78,19.56 | v1.91,57.4 5.71,57.4 5.97,57.66 5.89,57.74 IC1.8
  Bottom 0.254: v9.78,19.56 5.97,19.56 1.65,23.88 1.65,57.15 v1.91,57.4
D4  (via drill 0.35)
  Top 0.254: U1.2 10.31,17.76 v9.78,18.29 | v12.06,27.43 13.08,28.45 D3.C
  Bottom 0.254: v9.78,18.29 12.06,20.57 v12.06,27.43
D11/MOSI
  Top 0.254: U1.15 18.64,10.64 18.44,10.44 14.12,10.44 J3.4
D12/MISO  (via drill 0.35)
  Top 0.254: 19.43,10.92 U1.16 19.97,12.17 v20.25,12.17 | v8.31,9.07 8.31,7.57 J3.1
  Bottom 0.254: v20.25,12.17 11.41,12.17 v8.31,9.07
D13/SCK  (via drill 0.35)
  Top 0.254: J3.3 13.59,7.37 15.62,7.37 v16.64,7.87 | v22.73,12.7 22.48,12.95 U1.17 | v26.54,20.57 27.54,19.57 R7.2
  Bottom 0.254: v16.64,7.87 17.91,7.87 v22.73,12.7 23.11,13.08 23.11,15.96 22.58,16.49 22.58,17.92 24.05,19.39 25.36,19.39 v26.54,20.57
DEN_3V
  Bottom 0.152: IC3.13 20.12,38.66 19.18,37.72 R19.1
GND  (via drill 0.35)
  Top 0.152: v24.26,46.1 22.1,46.1 v21.97,46.23
  Top 0.254: CN1.GND v35.43,12.7 | v35.69,16.26 35.69,17.67 U2.18 35.7,19.06 v35.94,19.3 | v35.69,21.59 37.47,23.37 v37.72,23.37 | v38.99,21.84 40.25,20.59 U2.25 | v23.24,16.76 22.63,16.15 U1.21 18.77,16.15 v18.67,16.26 | v25.78,15.75 26.51,15.75 LED2.C | U1.3 13.71,16.94 v14.03,16.61 | v35.2,51.29 36.07,52.15 U3.P$52 | 5.48,50.34 7.22,50.34 7.38,50.51 7.38,51.98 7.24,52.12 v7.24,53.59 | 6.61,52.75 6.61,53.08 | v37.08,59.05 40.13,59.05 X1.GND@2 | IC1.4 3.94,52.23 NETSTAT.C | IC1.1 1.99,55.2 v2.67,55.88
  Bottom 0.152: IC3.17 21.77,41.07 IC3.18 | C15.2 v24.26,46.1 | v21.97,46.23 21.84,46.1 C16.2
  Bottom 0.254: SW2.P$2 25.05,5.5 C10.2 34.52,5.27 C11.1 | v35.43,12.7 35.69,12.95 v35.69,16.26 | v35.94,19.3 35.94,21.34 v35.69,21.59 | v38.99,21.84 38.99,22.1 40.09,22.1 40.24,21.95 40.78,21.95 41.17,22.33 41.17,22.88 40.78,23.26 37.82,23.26 v37.72,23.37 | 27.81,17.27 27.3,16.76 v23.24,16.76 24.77,16.76 v25.78,15.75 | U5.2 U4.2 | v14.03,16.61 15.3,16.61 15.35,16.66 18.27,16.66 v18.67,16.26 | D4.2 34.46,50.55 v35.2,51.29 | X1.GND@2 37.21,58.93 v37.08,59.05 | X2.5 v7.24,53.59
  Bottom 0.305: C2.1 22.48,24.07 C4.2
  other vias: 7.49,17.24 3.17,17.24 22.23,24.32 24.77,24.07
  pour Top: 0.13,-0.13 0.25,71.63 43.94,71.76 44.07,-0.13
  pour Bottom: 0.13,-0.25 0.13,71.76 43.81,71.76 43.94,-0.13
GSM_ANT
  Top 0.406: U3.P$66 22.07,55.85 27.69,61.47 X1.P
GSM_RESET
  Top 0.254: U3.P$16 13.96,33.89 13.08,33.02 D3.A
N$1  (via drill 0.35)
  Top 0.254: Y1.2 22.42,10.86 C3.2 v21.21,12.17 | U1.8 v13.84,12.95
  Bottom 0.254: v13.84,12.95 20.42,12.95 v21.21,12.17
N$2  (via drill 0.35)
  Top 0.254: U1.7 17.68,13.74 v19.05,15.11 | Y1.1 24.26,18.54 v24.26,20.57 24,20.32 22.48,20.32 22.23,20.57 C2.2
  Bottom 0.254: v19.05,15.11 24.26,20.32 v24.26,20.57
N$3
  Top 0.406: X3.3 42.29,51.05 42.29,33.4 41.78,32.89 U3.P$35
N$4
  Top 0.254: R4.1 3.33,49.34 PWRSTAT.A
N$6
  Top 0.254: R8.1 LED2.A
N$7
  Top 0.254: U1.30 15.44,21.78 R2.2
N$8  (via drill 0.35)
  Top 0.254: U1.31 14.63,21.26 v14.61,21.29 | v16.13,21.34 16.89,22.1 R3.2
  Bottom 0.254: v14.61,21.29 14.65,21.34 v16.13,21.34
N$9
  Top 0.254: R5.1 6.25,49.24 NETSTAT.A
N$10
  Top 0.254: CN1.D+ 34.16,10.16 33.66,10.67 33.66,17.59 U2.15
N$11  (via drill 0.35)
  Top 0.254: v34.42,16.26 34.42,17.66 U2.16 | CN1.D- 33.96,9.36 v33.66,9.66
  Bottom 0.254: v33.66,9.66 33.66,15.5 v34.42,16.26
N$12
  Top 0.254: R9.1 33.15,12.46 33.15,18.54 33.91,20.07 37.47,20.07 38.3,18.73 U2.22
N$13
  Top 0.254: R10.1 31.11,12.46 31.11,18.29 33.15,20.57 38.23,20.57 38.95,19.09 U2.23
N$14
  Top 0.254: R9.2 LED3.C
N$15
  Top 0.254: R10.2 LED4.C
N$16  (via drill 0.35)
  Top 0.254: C8.1 19.11,8.44 19.94,7.62 22.23,7.62 v22.73,8.13 | v40.51,22.61 41.55,23.64 U2.2
  Bottom 0.254: v22.73,8.13 29.34,14.73 29.34,18.03 33.91,22.61 v40.51,22.61
N$17
  Top 0.254: R11.1 CHRG.C
N$18  (via drill 0.35)
  Top 0.254: R12.2 R11.2 6.65,26.4 6.19,26.4 5.54,26.42 5.21,26.42 4.7,25.65 4.7,18.8 v4.95,18.54 | v2.29,18.54 2.23,17.59 U4.1
  Bottom 0.254: v4.95,18.54 v2.29,18.54
N$19
  Top 0.254: U4.5 2.16,19.91 R13.1
N$20
  Top 0.254: R12.1 DONE.A
N$21
  Top 0.254: U4.4 4.12,20.13 4.06,20.83 4.06,24.64 2.12,25.94 CHRG.A 3.14,28.7 3.17,28.7 3.17,30.73 3.44,31 6.52,31 6.53,30.99 6.73,30.99 7.68,31.94 R14.2 9.02,33.59 S1.S 9.02,37.4 C12.1
N$22
  Top 0.254: D2.C 3.61,37.08 5.59,37.08 6.48,36.2 S1.P
N$24
  Top 0.254: CHRG_INDC.A R14.1
N$25
  Top 0.254: R7.1 LED1.A
NETSTAT
  Top 0.254: IC1.5 4.59,53.86 5.21,54.48 15.11,54.48 21.7,47.89 U3.P$50
NETSTAT_5V
  Top 0.254: IC1.6 5.24,52.42 5.44,52.22 5.54,52.22 6.35,51.41 R5.2
PWRKEY  (via drill 0.35)
  Top 0.254: v17.4,41.91 17.38,41.89 U3.P$8 | S2.3 10.41,61 S2.4
  Top 0.305: U3.P$8 16.06,42.29 16.62,42.29 17.4,43.07 17.4,49.02 12.83,53.59 v12.57,53.59 | v10.29,56.01 10.29,60.87 10.41,61
  Bottom 0.254: D8.A 17.65,42.16 v17.4,41.91
  Bottom 0.305: v12.57,53.59 10.29,55.88 v10.29,56.01
PWRSTAT  (via drill 0.35)
  Top 0.254: v23.37,48.64 21.84,48.64 15.49,54.99 2.86,54.99 2.64,54.77 IC1.2 | v25.78,47.12 26,46.89 U3.P$49
  Bottom 0.254: v23.37,48.64 24.26,48.64 v25.78,47.12
PWRSTAT_5V
  Top 0.254: R4.2 1.91,51.7 2.56,52.35 2.93,52.35 3.09,52.52 3.09,52.89 IC1.3
RESET  (via drill 0.35)
  Top 0.254: J3.5 SW2.P$1 17.96,8.65 C8.2 | U1.29 16.23,16.61 v15.62,16 | v12.32,11.43 v10.79,12.95 10.05,12.21 R1.1
  Bottom 0.254: v15.62,16 14.35,16 12.57,14.22 12.06,14.22 v10.79,12.95 | C8.2 15.82,9.4 15.36,9.85 13.89,9.85 v12.32,11.43
  other vias: 17.21,9.4
RI  (via drill 0.35)
  Top 0.254: v3.81,62.36 3.68,62.23 1.65,62.23 1.27,61.85 1.27,60.32 1.78,59.82 2.92,59.82 3.29,59.45 IC1.12
  Top 0.305: U3.P$10 17.41,39.89 18.54,41.02 18.54,49.15 v14.35,53.34
  Bottom 0.254: v3.81,62.36 4.66,62.36 4.68,62.38 5.31,62.38 7.48,60.21
  Bottom 0.305: v14.35,53.34 7.48,60.21
RTS
  Top 0.305: R6.1 13.85,36.89 U3.P$13
SCL_3V
  Bottom 0.152: IC3.2 25.16,40.52 25.27,40.64 25.27,41.32 Q2.2 R15.1
SDA_3V  (via drill 0.35)
  Top 0.152: R16.1 8.43,21.56 Q1.2 8.72,21.46 v11.3,21.46
  Bottom 0.152: v11.3,21.46 11.3,30.48 12.45,31.62 26.16,31.62 30.48,35.56 30.48,38.61 29.04,39.66 IC3.4
SDO_AG
  Bottom 0.152: IC3.5 25.38,39.23 R22.2
SDO_M
  Bottom 0.152: IC3.6 25.65,37.75 25.65,36.58 25.91,36.32 R23.2
SIMCLK  (via drill 0.35)
  Top 0.254: v33.02,31.88 33.07,31.83 U3.P$31
  Bottom 0.254: X2.3 30.04,59.25 28.57,57.78 28.57,51.82 30.61,49.78 30.62,49.8 D4.4 32.12,32.78 v33.02,31.88
SIMDATA  (via drill 0.35)
  Top 0.254: v31.11,50.55 31.11,49.02 v31.24,48.89 | v31.24,45.97 32.64,44.58 32.64,34.8 v31.11,33.27 | v32.13,30.73 32.13,28.56 U3.P$30 | v30.1,51.43 20.07,51.43 11.51,59.99 11.51,61.76 11.34,61.92 9.56,61.92 9.36,61.72 v4.95,61.72
  Bottom 0.254: D4.5 v31.11,50.55 30.23,51.43 v30.1,51.43 | v31.24,48.89 v31.24,45.97 | v31.11,33.27 31.11,31.75 v32.13,30.73 | v4.95,61.72 4.19,60.96 2.67,60.96 2.16,60.45 2.16,58.93 2.67,58.42 4.22,58.42 X2.7
SIMRST  (via drill 0.35)
  Top 0.254: v34.04,31.5 34.07,31.46 U3.P$32
  Bottom 0.254: X2.2 33.46,56.71 36.07,54.61 36.07,50.67 34.68,49.8 D4.3 33.92,31.61 v34.04,31.5
UART_RXD
  Top 0.254: D7.A 13.08,25.27 15.49,27.69 16.51,27.69 19.94,31.12 19.94,33.15 19.56,33.53 18.54,33.53 17.14,34.92 15.7,34.92 U3.P$15
UART_TXD  (via drill 0.35)
  Top 0.305: U3.P$14 17.23,35.89 17.65,36.32 v17.65,37.59 | v7.24,57.78 7.24,59.31 6.22,60.32 5.46,60.32 5.24,60.1 IC1.9
  Bottom 0.305: v17.65,37.59 8.21,37.59 8.16,37.64 7.59,37.64 7.54,37.59 6.48,37.59 3.5,40.57 3.5,54.95 4.33,55.79 6.47,55.79 6.64,55.97 6.64,57.19 v7.24,57.78
VBAT  (via drill 0.35)
  Top 0.254: U4.3 4.12,17.97 3.56,19.05 3.56,20.53 3.57,20.79 3.57,24.13 | 3.57,24.13 3.57,24.17 | v2.67,44.58 3.29,45.2 BATT_IN.2 8.45,44.89 15.62,44.89 | 3.57,24.13 2.81,24.89 v2.31,24.89 | 15.62,44.89 U3.P$5 U3.P$4 | U3.P$6 15.67,44.85 15.62,44.89
  Bottom 0.254: v2.31,24.89 2.31,36.43 2.29,36.45 2.29,44.2 v2.67,44.58
VDD  (via drill 0.35, 0.4)
  Top 0.152: Q1.1 10.47,23.56 15.37,28.45 16,28.45 19.05,31.5 v19.05,32.51 | v29.84,38.1 30.86,39.24 v31.37,39.24 30.28,40.34 27.59,40.34 v27.55,40.3 27.17,40.68 27.17,42.68 v25.91,43.94
  Top 0.254: Q1.1 6.58,23.56 | 6.58,23.56 R16.2 5.21,22.39 5.21,20.57 5.94,19.84 U5.5 | C14.1 6.8,23.78 6.58,23.56
  Bottom 0.152: v19.05,32.51 19.05,34.74 R19.2 R21.1 21.65,35.56 24.07,35.56 R20.1 27.05,35.12 R23.1 28.51,38 R22.1 v29.84,38.1 | IC3.3 25.95,40.09 Q2.1 | v31.37,39.24 30.16,40.45 R15.2 | Q2.1 26.3,40.5 | IC3.1 24.75,41.45 25.24,41.94 25.24,43.27 v25.91,43.94 25.91,45.09 24.77,46.86 23.62,46.86 22.99,45.59 22.99,42.04 23.46,41.57 IC3.22 IC3.23 | Q2.1 26.45,40.3 v27.55,40.3
VIN  (via drill 0.35)
  Top 0.254: 8,13.94 8,14.97 v7.99,14.98 | R17.2 R18.2
  Top 0.406: J3.2 8,10.41 8,13.94 IC2.1
  Bottom 0.254: v7.99,14.98 7.99,15.33 7.85,15.48 7.85,16.02 9.1,17.27 16.89,17.27 20.45,20.83 R17.2
  other vias: 20.45,24.45
VRTC
  Top 0.254: U3.P$17 14.86,32.09 C9.1
VUSB  (via drill 0.35)
  Top 0.254: D1.A 32.64,9.4 v33.15,8.89 33.73,8.56 CN1.VBUS 36.68,8.56 38.1,9.98 39.88,9.98 40.51,10.62 40.51,12.75 39.52,13.74 39.52,15.77 v39.6,15.85 | v41.76,27.58 41.17,27 27.48,27 27.07,27.42 U3.P$25
  Top 0.305: D2.A 7.44,36.96 v7.87,36.96 | v17.53,32.51 16.89,31.88 v16.89,30.61 | v26.92,30.1 27.07,29.96 U3.P$25
  Bottom 0.254: v33.15,8.89 33.15,8.34 C10.1 36.17,7.2 C11.2 | v39.6,15.85 39.6,20.19 42.7,23.28 42.7,26.69 42.31,27.07 42.27,27.07 v41.76,27.58
  Bottom 0.305: v7.87,36.96 13.08,36.96 v17.53,32.51 | v16.89,30.61 26.42,30.61 v26.92,30.1

### Text on the board
tPlace: Frisbie Board Rev. A | Designed by: Shawn Victor & Grace Jiang